# Altium project PCB_Project1.PrjPCB
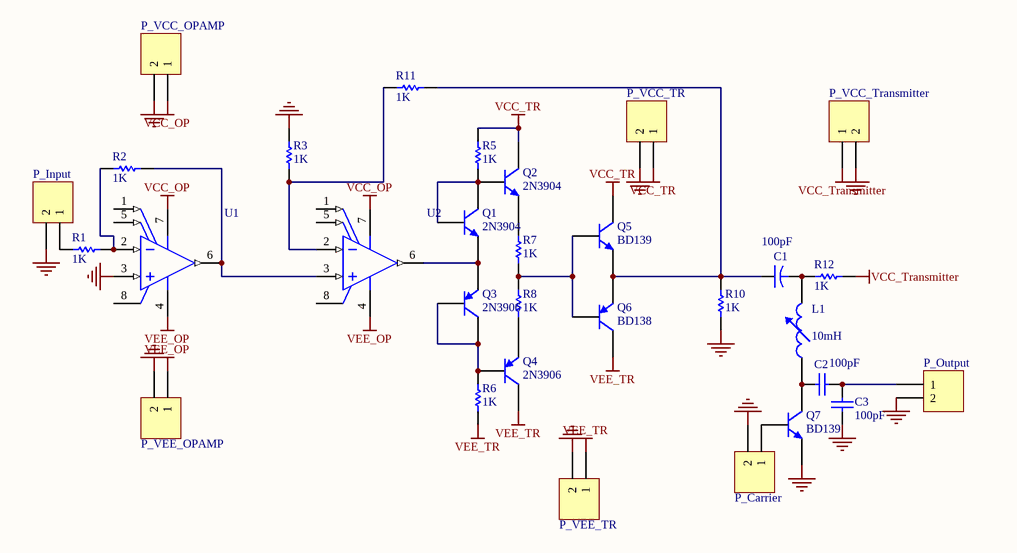
[diagram p0: Sheet1.SchDoc]
1 sheet, 31 parts. Net scope: global (net labels, ports and power ports of the same name join across sheets).
Board file: PCB1.PcbDoc

## Sheet Sheet1.SchDoc
size A

### Parts
C1  value 100pF  [CAPR5-4X5]  (hidden comment: Cap2)
C2  value 100pF  [RAD-0.3]  (hidden comment: Cap)
C3  value 100pF  [RAD-0.3]  (hidden comment: Cap)
L1  value 10mH  [AXIAL-0.8]  (hidden comment: Inductor Adj)
P_Carrier  Header 2  [HDR1X2]  (value not drawn)
P_Input  Header 2  [HDR1X2]  (value not drawn)
P_Output  Header 2  [HDR1X2]  (value not drawn)
P_VCC_OPAMP  Header 2  [HDR1X2]  (value not drawn)
P_VCC_TR  Header 2  [HDR1X2]  (value not drawn)
P_VCC_Transmitter  Header 2  [HDR1X2]  (value not drawn)
P_VEE_OPAMP  Header 2  [HDR1X2]  (value not drawn)
P_VEE_TR  Header 2  [HDR1X2]  (value not drawn)
Q1  2N3904  [TO-92A]
Q2  2N3904  [TO-92A]
Q3  2N3906  [TO-92A]
Q4  2N3906  [TO-92A]
Q5  BD139  [SOT-32]
Q6  BD138  [SOT-32]
Q7  BD139  [SOT-32]
R1  value 1K  [AXIAL-0.3]  (hidden comment: Res1)
R2  value 1K  [AXIAL-0.3]  (hidden comment: Res1)
R3  value 1K  [AXIAL-0.3]  (hidden comment: Res1)
R5  value 1K  [AXIAL-0.3]  (hidden comment: Res1)
R6  value 1K  [AXIAL-0.3]  (hidden comment: Res1)
R7  value 1K  [AXIAL-0.3]  (hidden comment: Res1)
R8  value 1K  [AXIAL-0.3]  (hidden comment: Res1)
R10  value 1K  [AXIAL-0.3]  (hidden comment: Res1)
R11  value 1K  [AXIAL-0.3]  (hidden comment: Res1)
R12  value 1K  [AXIAL-0.3]  (hidden comment: Res1)
U1  UA741CP  [TI-P8]  (value not drawn)
U2  UA741CP  [TI-P8]  (value not drawn)

### Nets
GND: C3.1 P_Carrier.2 P_Input.2 P_Output.2 P_VCC_OPAMP.2 P_VCC_TR.2 P_VCC_Transmitter.2 P_VEE_OPAMP.2 P_VEE_TR.2 Q7.E R3.2 R10.1 U1.3(IN+)
VCC_OP: P_VCC_OPAMP.1 U1.7(VCC+) U2.7(VCC+)
VCC_TR: P_VCC_TR.1 Q2.3(C) Q5.C R5.2
VCC_Transmitter: P_VCC_Transmitter.1 R12.1
VEE_OP: P_VEE_OPAMP.1 U1.4(VCC-) U2.4(VCC-)
VEE_TR: P_VEE_TR.1 Q4.3(C) Q6.C R6.1
NetC1_1: C1.1 Q5.E Q6.E R10.2 R11.1
NetC1_2: C1.2 L1.2 R12.2
NetC2_1: C2.1 L1.1 Q7.C
NetC2_2: C2.2 C3.2 P_Output.1
NetP_Carrier_1: P_Carrier.1 Q7.B
NetP_Input_1: P_Input.1 R1.2
NetQ1_1: Q1.1(E) Q3.1(E) U2.6(OUT)
NetQ1_2: Q1.2(B) Q1.3(C) Q2.2(B) R5.1
NetQ2_1: Q2.1(E) R7.2
NetQ3_2: Q3.2(B) Q3.3(C) Q4.2(B) R6.2
NetQ4_1: Q4.1(E) R8.1
NetQ5_B: Q5.B Q6.B R7.1 R8.2
NetR1_1: R1.1 R2.1 U1.2(IN-)
NetR2_2: R2.2 U1.6(OUT) U2.3(IN+)
NetR3_1: R3.1 R11.2 U2.2(IN-)

Not connected (* = marked no-connect by the designer): U1 1(OFFSET_N1) 5(OFFSET_N2) 8(NC); U2 1(OFFSET_N1) 5(OFFSET_N2) 8(NC)

### Library data of the parts
C1 = Cap2: Capacitor; Published: 23-Sep-2002; PackageReference: CAPR5-4X5; Publisher: Altium Limited; PackageDescription: Capacitor; 2 Leads
C2 C3 = Cap: Capacitor; Published: 8-Jun-2000; LatestRevisionDate: 17-Jul-2002; LatestRevisionNote: Re-released for DXP Platform.; PackageReference: RAD-0.3; Publisher: Altium Limited; PackageDescription: Radial Cap, Thru-Hole; 2 Leads; 0.3 in Pin Spacing
L1 = Inductor Adj: Adjustable Inductor; Set Position: 0.5; Published: 24-Mar-1999; LatestRevisionDate: 17-Jul-2002; LatestRevisionNote: Re-released for DXP Platform.; PackageReference: AXIAL-0.8; Publisher: Altium Limited; PackageDescription: Axial Device, Thru-Hole; 2 Leads; 0.8 in Pin Spacing
P_Carrier P_Input P_Output P_VCC_OPAMP P_VCC_TR P_VCC_Transmitter P_VEE_OPAMP P_VEE_TR = Header 2: Header, 2-Pin; LatestRevisionDate: 17-Jul-2002; LatestRevisionNote: Re-released for DXP Platform.; Publisher: Altium Limited
Q1 Q2 = 2N3904: NPN General Purpose Amplifier; Published: 8-Jun-2000; LatestRevisionDate: 15-Jan-2003; LatestRevisionNote: PCB Footprint 'BCY-W3/D4.7' replaced; DatasheetVersion: 1997; PackageVersion: Sep-1998; PackageReference: TO-92A; Publisher: Altium Limited; PackageDescription: TO, Flat Index; 3 In-Line, Axial Leads; Body Dia. 4.5mm; Leads 0.51 x 0.48 mm (max); ComponentLink1Description: Manufacturer Link; ComponentLink1URL: http://www.fairchildsemi.com/; ComponentLink2Description: Datasheet; ComponentLink2URL: http://www.fairchildsemi.com/ds/2N%2F2N3904.pdf
Q3 Q4 = 2N3906: PNP General Purpose Amplifier; Published: 8-Jun-2000; LatestRevisionDate: 15-Jan-2003; LatestRevisionNote: PCB Footprint 'BCY-W3/D4.7' replaced; DatasheetVersion: 1997; PackageVersion: Sep-1998; PackageReference: TO-92A; Publisher: Altium Limited; PackageDescription: TO, Flat Index; 3 In-Line, Axial Leads; Body Dia. 4.5mm; Leads 0.51 x 0.48 mm (max); ComponentLink1Description: Manufacturer Link; ComponentLink1URL: http://www.fairchildsemi.com/; ComponentLink2Description: Datasheet; ComponentLink2URL: http://www.fairchildsemi.com/ds/2N%2F2N3906.pdf
Q5 Q7 = BD139: NPN Transistor; E-mail: picpars@gmail.com; De: Seyed Mohsen Ghasemian; web: www.picpars.com
Q6 = BD138: PNP Transistor; E-mail: picpars@gmail.com; De: Seyed Mohsen Ghasemian; web: www.picpars.com
R1-R3 R5-R8 R10-R12 = Res1: Resistor; Published: 8-Jun-2000; LatestRevisionDate: 17-Jul-2002; LatestRevisionNote: Re-released for DXP Platform.; PackageReference: AXIAL-0.3; Publisher: Altium Limited; PackageDescription: Axial Device, Thru-Hole; 2 Leads; 0.3 in Pin Spacing
U1 U2 = UA741CP: General-Purpose Operational Amplifier, 7 to 36 V, 0 to 70 degC, 8-pin DIP (P8), Pb-Free (RoHS); Manufacturer: Texas Instruments; CMRR(Min)(dB): 70; GBW(Typ)(MHz): 1; IIB(Max)(pA): 800000; Iq per channel(Max)(mA): 2.8; Slew Rate(Typ)(V/us): 0.5; Sub Family: General Purpose Amplifier, High Supply Voltage Amplifier (>=30V); Total Supply Voltage(Max)(+5V is 5, +/-5V is 10): 36; Total Supply Voltage(Min)(+5V is 5, +/-5V is 10): 7; Vio (25C)(Max)(mV): 6; DatasheetVersion: SLOS094B; PackageVersion: 4040082/E, 04/2010; PackageReference: P8; PackageDescription: 8-Pin Plastic In-Line, Body 9.59 x 6.35 mm, Pitch 2.54 mm; Supplier 1: Digi-Key; Supplier Part Number 1: 296-11107-5-ND; Supplier 2: Farnell; Supplier Part Number 2: 1564944; Supplier 3: Newark; Supplier Part Number 3: 60K7043; Supplier 4: Mouser; Supplier Part Number 4: 595-UA741CP; Eco-Plan: Pb-Free (RoHS); Number of Channels: 1; Mounting Technology: Through Hole; Code_JEDEC: MS-001; PartNumber: UA741CP; ComponentLink1Description: Manufacturer URL; ComponentLink1URL: http://www.ti.com/; ComponentLink2Description: Datasheet; ComponentLink2URL: http://www.ti.com/lit/ds/symlink/ua741.pdf; ComponentLink3Description: Package Specification; ComponentLink3URL: http://www.ti.com/litv/pdf/mpdi001b